# EAGLE schematic sensor (EAGLE 9.6.2)
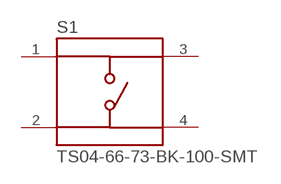
[diagram p0: schematic, sheet 1]

## Parts
S1  TS04-66-73-BK-100-SMT  [SW_TS04-66-73-BK-100-SMT]
Unconnected: S1.1 S1.2 S1.3 S1.4

## Library data of the parts
S1 = TS04-66-73-BK-100-SMT:TS04-66-73-BK-100-SMT; MANUFACTURER: CUI Devices; PARTREV: 1.0; STANDARD: Manufacturer Recommendations